# Altium project machthu.PrjPCB
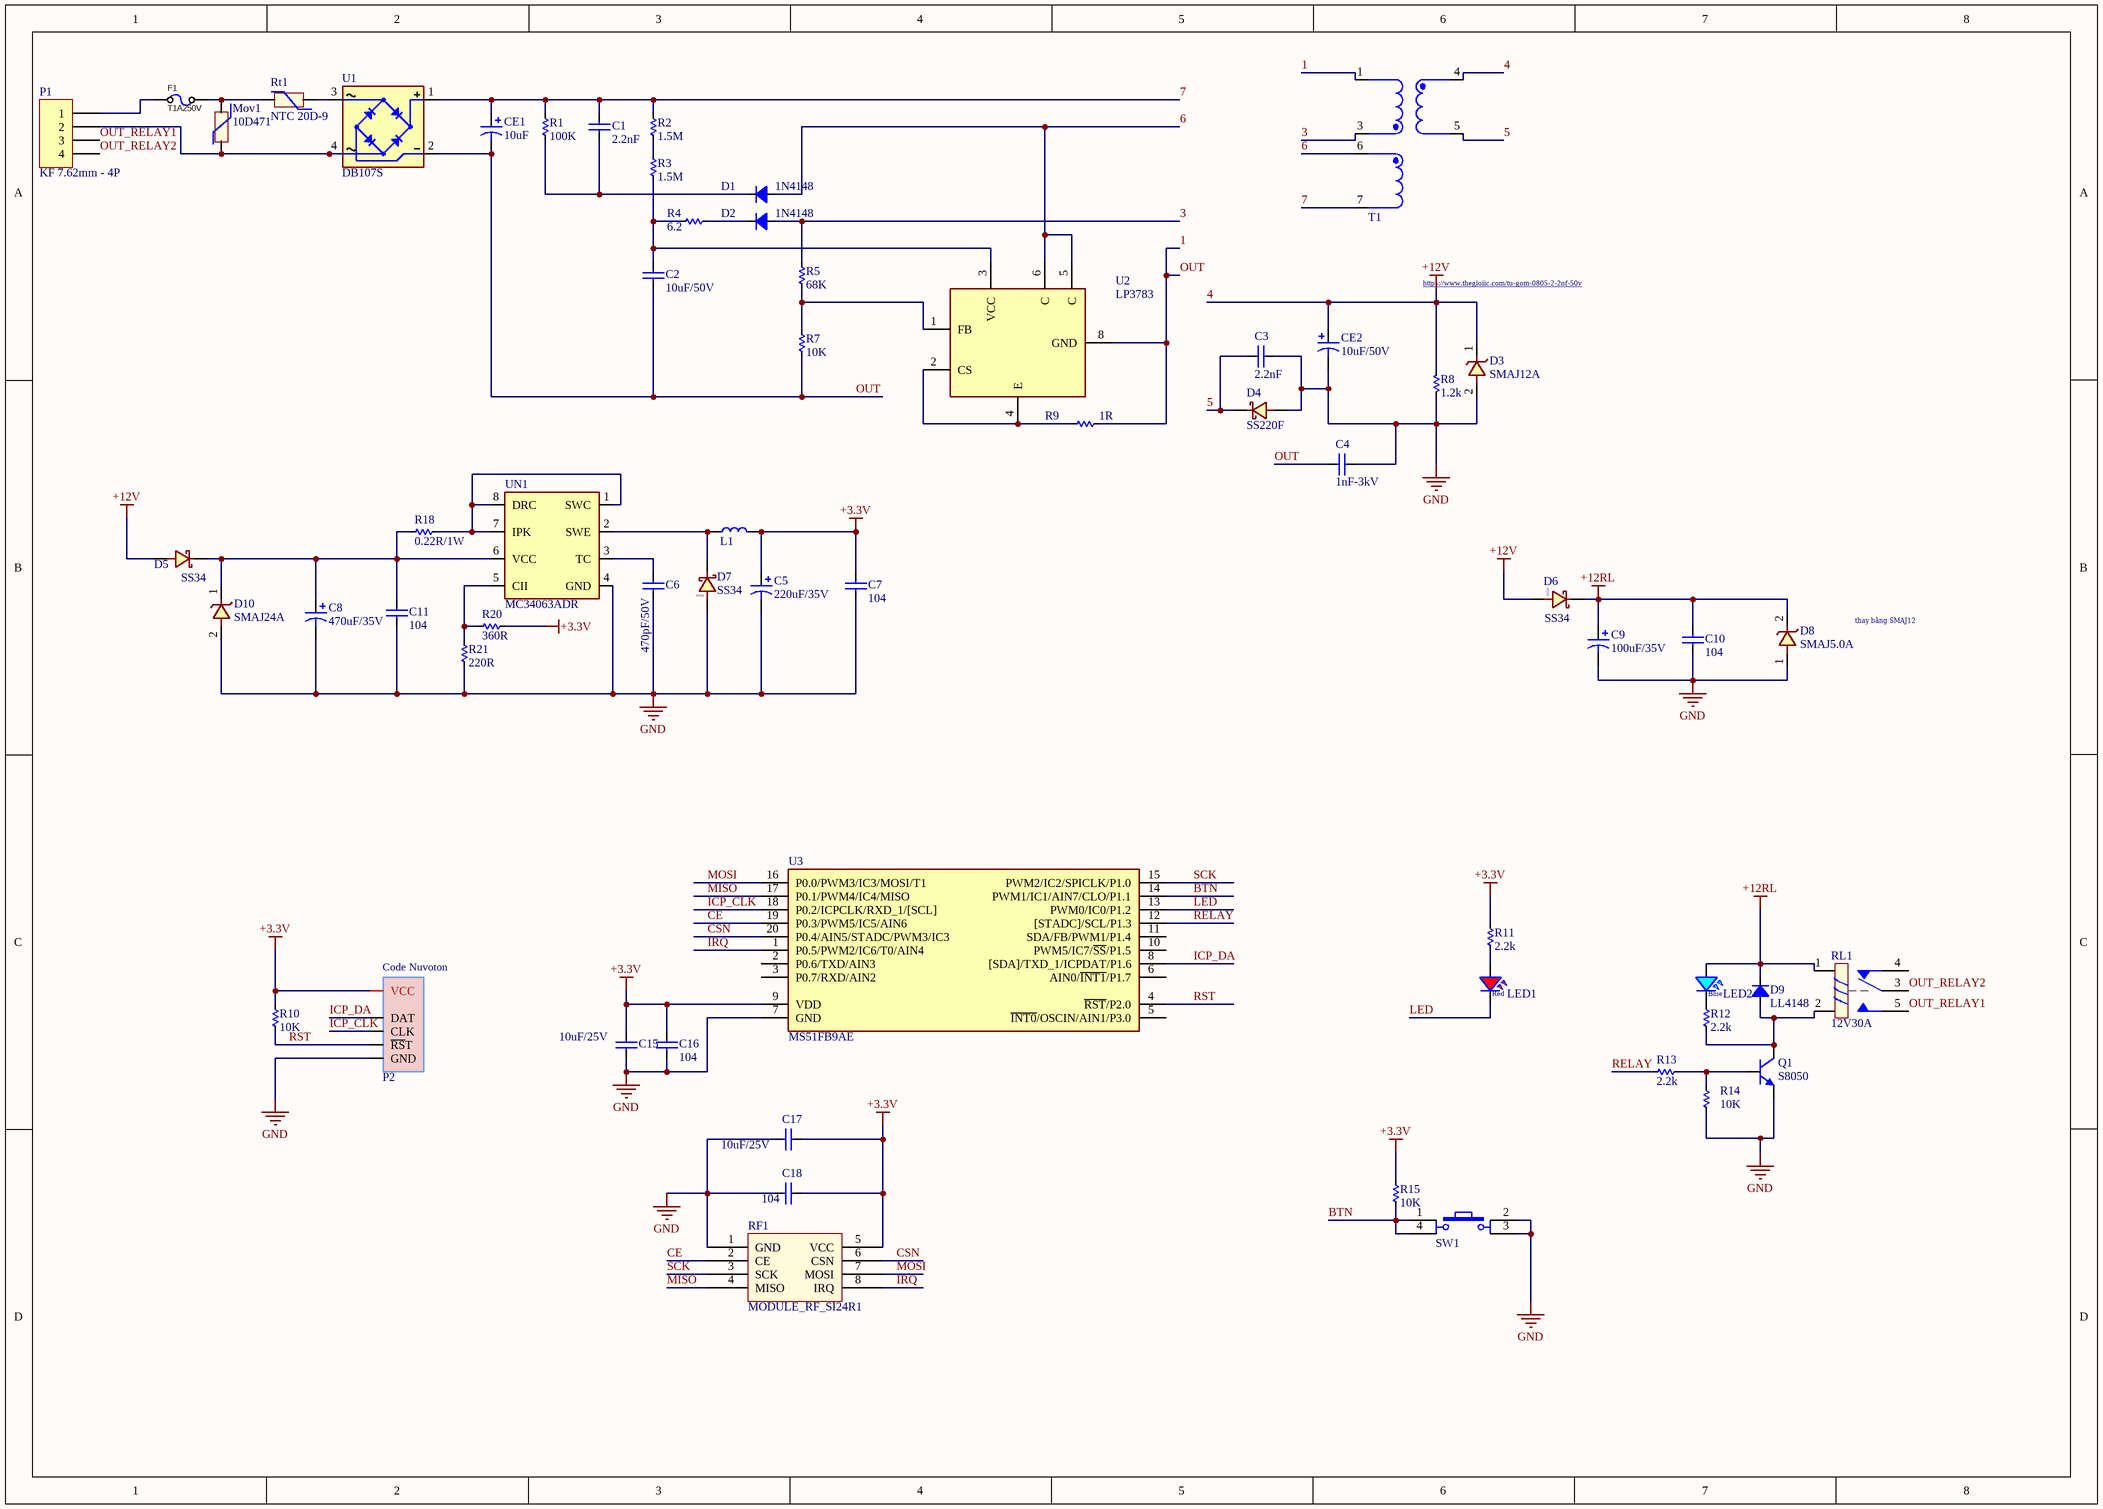
[diagram p0: schematic.SchDoc]
1 sheet, 61 parts. Net scope: global (net labels, ports and power ports of the same name join across sheets).
Board files: pcb.PcbDoc, panel 2x4.PcbDoc

## Sheet schematic.SchDoc: <Project Name>
size A3; ENG_APP_DATE: --/--/--; DSN_APP_DATE: --/--/--; CHK_APP_DATE: --/--/--; Engineer: Engineer; Address4: Thành phố Hồ Chí Minh; DocumentNumber: 1; Revision: 1.0; SheetNumber: 1; SheetTotal: 1

### Parts
C1  2.2nF  [C_0805_SMD]
C2  10uF/50V  [C_0805_SMD]
C3  2.2nF  [C_0805_SMD]
C4  1nF-3kV  [CAP_CERAMIC d5.08]
C5  220uF/35V  [C8X12mm]
C6  470pF/50V  [C_0805_SMD]
C7  104  [C_0805_SMD]
C8  470uF/35V  [C10mm]
C9  100uF/35V  [C_6.3x12]
C10  104  [C_0805_SMD]
C11  104  [C_0805_SMD]
C15  10uF/25V  [C_0805_SMD]
C16  104  [C_0805_SMD]
C17  10uF/25V  [C_0805_SMD]
C18  104  [C_0805_SMD]
CE1  10uF  [C_8X12]
CE2  10uF/50V  [C5mm]
D1  1N4148  [D_SOD323]
D2  1N4148  [D_SOD323]
D3  SMAJ12A  [DO_241AC_SMA_MFG]
D4  SS220F  [D_SMA]
D5  SS34  [D_SMA]
D6  SS34  [D_SMA]
D7  SS34  [D_SMA]
D8  SMAJ5.0A  [D_SMA]
D9  LL4148  [SOD80C_MFG]
D10  SMAJ24A  [DO_241AC_SMA_MFG]
F1  T1A250V  [Fuse 392]
L1  220uH  [CDRH74]  (value not drawn)
LED1  LED D5 Red  [LED 5mm RED]  (value not drawn)
LED2  LED D5 Blue  [LED 5MM BLUE]  (value not drawn)
Mov1  10D471  [MOV-10D471]
P1  KF 7.62mm - 4P  [KF 7.62 - 4]
P2  Nuvoton  [Header Code Nuvoton 2.54 6P]  (value not drawn)  (no BOM)
Q1  S8050  [SOT23_N NXP]
R1  100K  [RES-SMD-0805]
R2  1.5M  [RES-SMD-0805]
R3  1.5M  [RES-SMD-0805]
R4  6.2  [RES-SMD-0805]
R5  68K  [RES-SMD-0805]
R7  10K  [RES-SMD-0805]
R8  1.2k  [RES-SMD-0805]
R9  1R  [RES-SMD-1206]
R10  10K  [RES-SMD-0805]
R11  2.2k  [RES-SMD-0805]
R12  2.2k  [RES-SMD-0805]
R13  2.2k  [RES-SMD-0805]
R14  10K  [RES-SMD-0805]
R15  10K  [RES-SMD-0805]
R18  0.22R/1W  [RES-SMD-2512]
R20  360R  [RES-SMD-0805]
R21  220R  [RES-SMD-0805]
RF1  MODULE_RF_SI24R1  [MODULE-RF-Si24R1]
RL1  12V30A  [Relay 30A 5 Pin]
Rt1  NTC 20D-9  [NTC 5D-9]
SW1  BT4  [SW4-DIP 6x6x12]  (value not drawn)
T1  24V-7VA  [EE15]  (value not drawn)
U1  DB107S  [DBRG_DIPSMD_MINI]
U2  LP3783  [SO_8]
U3  MS51FB9AE  [SOG65_20]
UN1  MC34063ADR  [SO_8]

### Nets
4: CE2.1 D3.1 D5.1(A) D6.1(A) R8.1 T1.4  [also labelled +12V]
+3.3V: C5.1 C7.1 C15.1 C16.1 C17.2 C18.1 L1.2 P2.1(VCC) R10.1 R11.1 R15.1 R20.1 RF1.5(VCC) U3.9(VDD)
+12RL: C9.1 C10.1 D6.2(K) D8.2 D9.1 LED2.1 RL1.1
GND: C3.2 C4.1 C5.2 C6.1 C7.2 C8.2 C9.2 C10.2 C11.1 C15.2 C16.2 C17.1 C18.2 CE2.2 D3.2 D4.1(A) D7.1(A) D8.1 D10.2 P2.6(GND) Q1.2(E) R8.2 R14.1 R21.2 RF1.1(GND) SW1.2 SW1.3 U3.7(GND) UN1.4(GND)
1: C2.2 C4.2 CE1.2 R7.2 R9.2 T1.1 U1.2(DCOUT-) U2.8(GND)  [also labelled OUT]
3: D2.1 R5.1 T1.3
5: C3.1 D4.2(K) T1.5
6: D1.1 T1.6 U2.5(C) U2.6(C)
7: C1.2 CE1.1 R1.1 R2.1 T1.7 U1.1(DCOUT+)
BTN: R15.2 SW1.1 SW1.4 U3.14(PWM1/IC1/AIN7/CLO/P1.1)
CE: RF1.2(CE) U3.19(P0.3/PWM5/IC5/AIN6)
CSN: RF1.6(CSN) U3.20(P0.4/AIN5/STADC/PWM3/IC3)
ICP_CLK: P2.4(CLK) U3.18(P0.2/ICPCLK/RXD_1/[SCL])
ICP_DA: P2.3(DAT) U3.8([SDA]/TXD_1/ICPDAT/P1.6)
IRQ: RF1.8(IRQ) U3.1(P0.5/PWM2/IC6/T0/AIN4)
LED: LED1.2 U3.13(PWM0/IC0/P1.2)
MISO: RF1.4(MISO) U3.17(P0.1/PWM4/IC4/MISO)
MOSI: RF1.7(MOSI) U3.16(P0.0/PWM3/IC3/MOSI/T1)
OUT_RELAY1: P1.3 RL1.5
OUT_RELAY2: P1.4 RL1.3
RELAY: R13.2 U3.12([STADC]/SCL/P1.3)
RST: P2.5(~{RS}T) R10.2 U3.4(~{RST}/P2.0)
SCK: RF1.3(SCK) U3.15(PWM2/IC2/SPICLK/P1.0)
NetC1_1: C1.1 D1.2 R1.2
NetC2_1: C2.1 R3.2 R4.1 U2.3(VCC)
NetC6_2: C6.2 UN1.3(TC)
NetC8_1: C8.1 C11.2 D5.2(K) D10.1 R18.2 UN1.6(VCC)
NetD2_2: D2.2 R4.2
NetD7_2: D7.2(K) L1.1 UN1.2(SWE)
NetD9_2: D9.2 Q1.3(C) R12.2 RL1.2
NetF1_1: F1.1 P1.1
NetF1_2: F1.2 Mov1.1 Rt1.2
NetLED1_1: LED1.1 R11.2
NetLED2_2: LED2.2 R12.1
NetMov1_2: Mov1.2 P1.2 U1.4(ACIN1)
NetQ1_1: Q1.1(B) R13.1 R14.2
NetR2_2: R2.2 R3.1
NetR5_2: R5.2 R7.1 U2.1(FB)
NetR9_1: R9.1 U2.2(CS) U2.4(E)
NetR18_1: R18.1 UN1.1(SWC) UN1.7(IPK) UN1.8(DRC)
NetR20_2: R20.2 R21.1 UN1.5(CII)
NetRt1_1: Rt1.1 U1.3(ACIN2)

Not connected (* = marked no-connect by the designer): RL1 4; U3 2(P0.6/TXD/AIN3) 3(P0.7/RXD/AIN2) 5(~{INT0}/OSCIN/AIN1/P3.0) 6(AIN0/~{INT1}/P1.7) 10(PWM5/IC7/~{SS}/P1.5) 11(SDA/FB/PWM1/P1.4)

### Notes on the sheet
- https://www.thegioiic.com/tu-gom-0805-2-2nf-50v
- (near D8) thay bằng SMAJ12
- Title
- Size:
- Date:
- A4
- Number:
- Time:
- Revision:
- Sheet
- of
- File:
- (in symbol Header Code Nuvoton) Code Nuvoton
- (in symbol LED 5mm Blue) Blue
- (in symbol LED 5mm RED) Red

### Library data of the parts
C1 C3 = Cap 0805 2.2nF 50V: Tu 2.2nF 50V, SMD 0805; Code: 1438-062
C2 = Cap 0805 10uF 50V: Cap SMD 0805 10uF 50V; Code: 1438-100
C4 = Cap 1nF 1KV: 102 1KV High Voltage Ceramic Disk Capacitor; Code: N/A
C5 = Cap Pol 220uF/35V: Polarized Capacitor (Axial) 220uF 35V; Code: 1402-228
C6 = Cap 0805 470pF 50V: Cap SMD 0805  470pF 50V; Code: 1438-056
C7 C10 C11 C16 C18 = Cap 0805 104 100nF: Cap SMD 0805 104-100nF-0.1uF 50V; Code: 1438-080
C8 = Cap Pol 470uF/35V: Polarized Capacitor (Axial) 470uF 35V; Code: 1402-231
C9 = Cap Pol 100uF/35V: Polarized Capacitor (Axial) 100uF 35V; Code: 1402-225
C15 C17 = Cap 0805 10uF 25V: Cap SMD 0805 10uF; Code: 1436-100
CE1 = Cap Pol 10uF 400V: Polarized Capacitor (Axial); Code: 1404-338
CE2 = Cap Pol 10uF/50V: Polarized Capacitor (Axial) 10uF/50V; Code: N/A
D1 D2 = 1N4148WS - T4 SOD-323: T4-Rectifier Diode Small Signal Switching 100V 0.25A 4ns 2-Pin SOD-323; Code: 2001-025
D3 = TVS SMAJ12A-DO241AC: SMAJ12A Series 400 W 12 V Surface Mount Uni-Directional TVS Diode - DO-214AC; Code: 2006-023; Designed by: TranLuyen
D4 = SS220F-SMAF: 200V Independent Type 950mV@2A 2A SMAF Schottky Diodes ROHS; Code: N/A
D5-D7 = SS34-SMA: Surface-Mount Schottky Barrier Rectifier; Code: 2005-008
  D6 D7: Value: SS34
D8 = TVS SMAJ5_0A-E3-61-DO241AC: SMAJ5.0A Series 400 W 5 V Surface Mount Uni-Directional TVS Diode - DO-214AC; Code: 2006-010; Designed by: TranLuyen; ComponentLink1Description: Datasheet; ComponentLink1URL: https://datasheet.octopart.com/SMAJ5.0AHE3-61-Vishay-datasheet-15599035.pdf
D9 = LL4148: 0.2A, 100V, SOD80; Code: 2001-012; Designed by: Nhox
D10 = TVS SMAJ24A-DO241AC: SMAJ Series 400W Surface Mount Uni-Directional TVS Diode - DO-214AC; Designed by: TranLuyen; Code: N/A
F1 = FUSE 392 T1A250V: Code: 1609-006
L1 = CD74 7345-221 220uH: INDUCTOR SMD; Code: 1526-001
LED1 = LED 5mm RED: LED Single colour; Code: 8001-013
LED2 = LED 5mm Blue: LED Single colour; Code: 8001-008
Mov1 = Varistor 10D471K 470V: MOV-10DxxxK Series - Metal Oxide Varistor; Code: 1422-221; Designed by: TranLuyen
P1 = KF 7.62 - 4Pin: Code: 3519-036; ComponentLink1 Description: Manufacturer; ComponentLink2 Description: Datasheet; Designed by: Tran Luyen; ComponentLink1URL: http://www.we-online.com; ComponentLink2URL: http://katalog.we-online.de/em/datasheet/6911031100xx.pdf
P2 = Header Code Nuvoton: Header 6-5Pin
Q1 = S8050 SOT-23: J3Y-NPN SMD Transistor SOT23; Code: 1701-070
R1 = Res 100k 0805: Resistor SMD 0805; Code: 1024-137
R2 R3 = Res 1.5M 0805: Resistor SMD 0805; Code: 1024-166
R4 = Res 6.2 0805: Resistor SMD 0805; Code: 1024-033
R5 = Res 68K 0805: Resistor SMD 0805; Code: 1024-133
R7 R10 R14 R15 = Res 10k 0805: Resistor SMD 0805; Code: 1024-111
R8 = Res 1.2k 0805: Resistor SMD 0805; Code: 1024-088
R9 = Res 1R 1206: Resistor SMD 1206; Code: 1030-017
R11-R13 = Res 2.2K 0805: Resistor SMD 0805; Code: 1024-094
R18 = Res 0.22R 2512 1W: Resistor SMD 2512 1W; Code: 1032-005
R20 = Res 360R 0805: Resistor SMD 0805; Code: 1024-075
R21 = Res 220R 0805: Resistor SMD 0805; Code: 1025-071
RF1 = MODULE RF SI24R1
RL1 = Relay SLA-12VDC-SL-A-30A 5P: Code: 2403-209
Rt1 = NTC 20D-9: NTC Thermistor; Code: N/A
SW1 = SW4 DIP 6x6x12mm: Switch button 4 pin 6x6 mm DIP; Code: 3610-009; Designed by: TranLuyen
T1 = TRANS EE15 5V-2A: Transformer EE15 6 PIN; Code: N/A
U1 = MB10F 1KV 0.5A: BRIDGE RECTIFIER 1KV 1A; Code: 2002-019; Designed by: TranLuyen
U3 = MS51FB9AE: MS51FB9AE, ROM 16KB, RAM 256B + 1KB, SPROM 128B, 1T 8051-based CMOS up to 24Mhz; Code: 7201-019; Designed by: Nhox
UN1 = MC34063ADR: MC3x063A 1.5-A Peak Boost/Buck/Inverting Switching Regulators; Code: 5015-078; Designed by: TranLuyen; ComponentLink1Description: Datasheet; ComponentLink1URL: http://www.ti.com/lit/ds/symlink/mc33063a.pdf?src-supplier=Digi-Key
U2 = LP3783: Code: N/A